# Altium schematic sheet GPRS.SchDoc
size A3
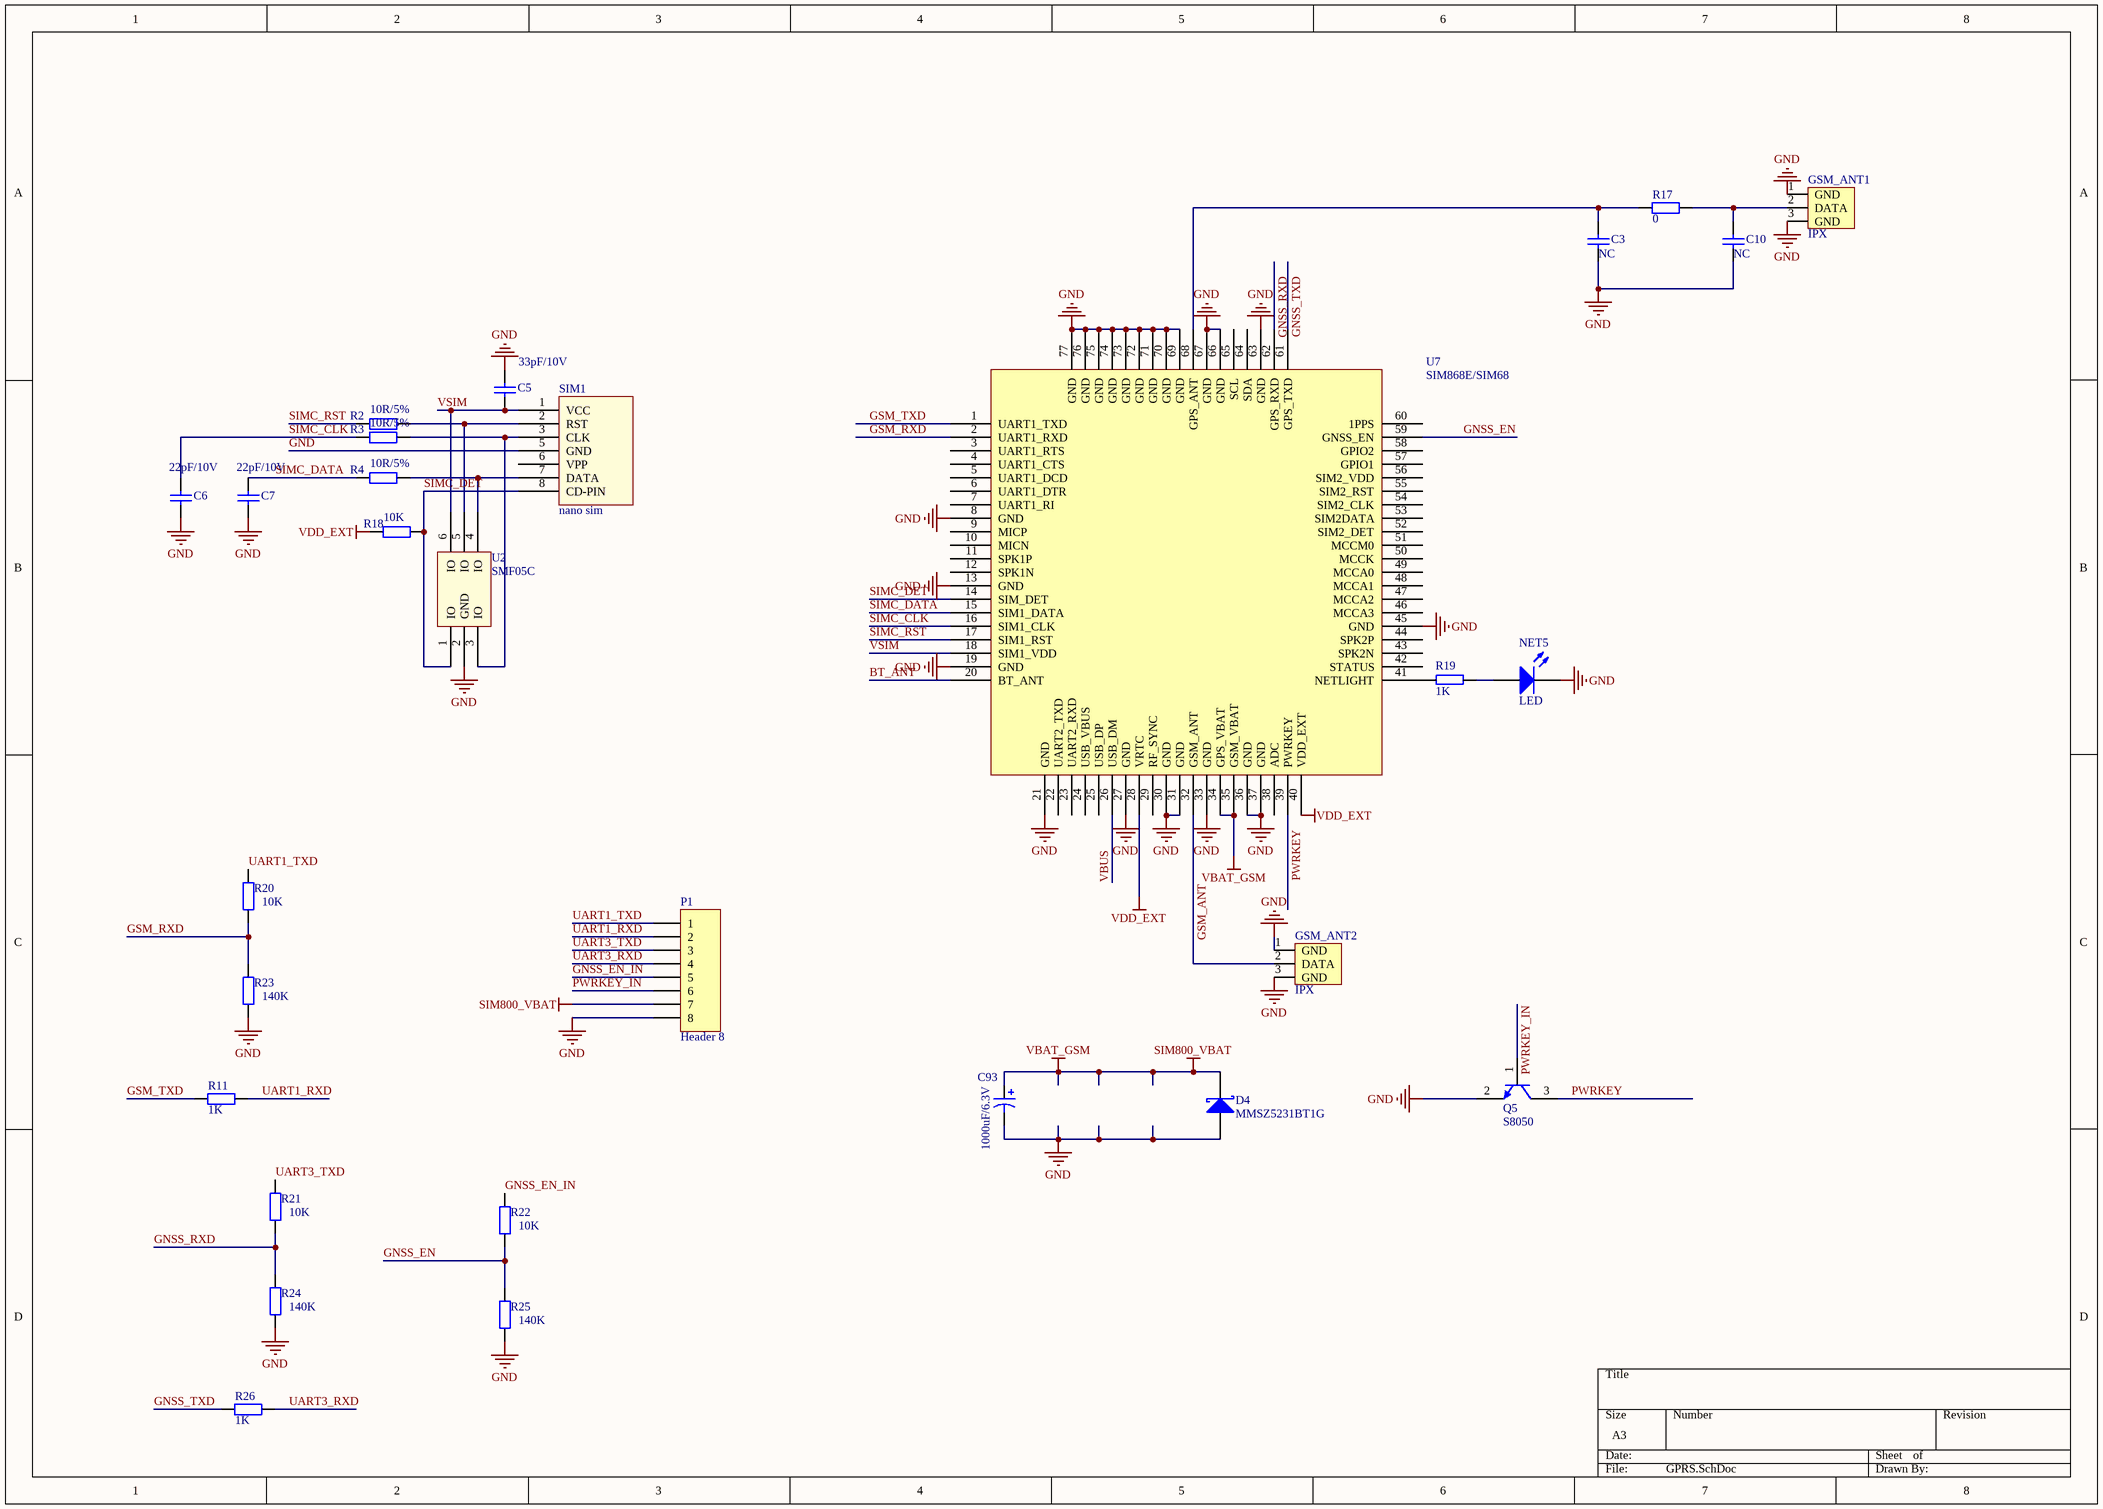
[diagram p0: GPRS.SchDoc]

## Parts
C3  NC  [0603C]
C5  33pF/10V  [0603C]
C6  22pF/10V  [0603C]
C7  22pF/10V  [0603C]
C10  NC  [0603C]
C93  1000uF/6.3V  [7343]
D4  MMSZ5231BT1G  [SOD123]
GSM_ANT1  IPX  [IPX]
GSM_ANT2  IPX  [IPX]
NET5  LED  [0603LED]
P1  Header 8  [HDR1X8]
Q5  S8050  [SOT23-3]
R2  10R/5%  [0603R]
R3  10R/5%  [0603R]
R4  10R/5%  [0603R]
R11  1K  [0603R]
R17  0  [0603R]
R18  10K  [0603R]
R19  1K  [0603r]
R20  10K  [0603R]
R21  10K  [0603R]
R22  10K  [0603R]
R23  140K  [0603R]
R24  140K  [0603R]
R25  140K  [0603R]
R26  1K  [0603R]
SIM1  nano sim  [Nano SIM]
U2  SMF05C  [SC70-6L]
U7  SIM868E/SIM68  [SIM868]

## Nets
GND: C3.2 C5.1 C6.2 C7.2 C10.2 C93.2 D4.1(A) GSM_ANT1.1(GND) GSM_ANT1.3(GND) GSM_ANT2.1(GND) GSM_ANT2.3(GND) NET5.2(K) P1.8 Q5.2(E) R23.2 R24.2 R25.2 SIM1.5(GND) U2.2(GND) U7.8(GND) U7.13(GND) U7.19(GND) U7.21(GND) U7.27(GND) U7.30(GND) U7.31(GND) U7.33(GND) U7.36(GND) U7.37(GND) U7.45(GND) U7.63(GND) U7.66(GND) U7.67(GND) U7.69(GND) U7.70(GND) U7.71(GND) U7.72(GND) U7.73(GND) U7.74(GND) U7.75(GND) U7.76(GND) U7.77(GND)
SIM800_VBAT: C93.1 D4.2(K) P1.7 U7.34(GPS_VBAT) U7.35(GSM_VBAT)  [also labelled VBAT_GSM]
VDD_EXT: R18.2 U7.28(VRTC) U7.40(VDD_EXT)
BT_ANT: U7.20(BT_ANT)
GNSS_EN: R22.2 R25.1 U7.59(GNSS_EN)
GNSS_EN_IN: P1.5 R22.1
GNSS_RXD: R21.2 R24.1 U7.62(GPS_RXD)
GNSS_TXD: R26.1 U7.61(GPS_TXD)
GSM_ANT: GSM_ANT2.2(DATA) U7.32(GSM_ANT)
GSM_RXD: R20.2 R23.1 U7.2(UART1_RXD)
GSM_TXD: R11.1 U7.1(UART1_TXD)
PWRKEY: Q5.3(C) U7.39(PWRKEY)
PWRKEY_IN: P1.6 Q5.1(B)
SIMC_CLK: C6.1 R3.2 U7.16(SIM1_CLK)
SIMC_DATA: C7.1 R4.2 U7.15(SIM1_DATA)
SIMC_DET: R18.1 SIM1.8(CD-PIN) U2.1(IO) U7.14(SIM_DET)
SIMC_RST: R2.2 U7.17(SIM1_RST)
UART1_RXD: P1.2 R11.2
UART1_TXD: P1.1 R20.1
UART3_RXD: P1.4 R26.2
UART3_TXD: P1.3 R21.1
VBUS: U7.26(USB_DM)
VSIM: C5.2 SIM1.1(VCC) U2.6(IO) U7.18(SIM1_VDD)
NetC3_1: C3.1 R17.1 U7.68(GPS_ANT)
NetC10_1: C10.1 GSM_ANT1.2(DATA) R17.2
NetNET5_1: NET5.1(A) R19.1
NetR2_1: R2.1 SIM1.2(RST) U2.5(IO)
NetR3_1: R3.1 SIM1.3(CLK) U2.3(IO)
NetR4_1: R4.1 SIM1.7(DATA) U2.4(IO)
NetR19_2: R19.2 U7.41(NETLIGHT)

Not connected (* = marked no-connect by the designer): SIM1 6(VPP); U7 3(UART1_RTS) 4(UART1_CTS) 5(UART1_DCD) 6(UART1_DTR) 7(UART1_RI) 9(MICP) 10(MICN) 11(SPK1P) 12(SPK1N) 22(UART2_TXD) 23(UART2_RXD) 24(USB_VBUS) 25(USB_DP) 29(RF_SYNC) 38(ADC) 42(STATUS) 43(SPK2N) 44(SPK2P) 46(MCCA3) 47(MCCA2) 48(MCCA1) 49(MCCA0) 50(MCCK) 51(MCCM0) 52(SIM2_DET) 53(SIM2DATA) 54(SIM2_CLK) 55(SIM2_RST) 56(SIM2_VDD) 57(GPIO1) 58(GPIO2) 60(1PPS) 64(SDA) 65(SCL)

## Library data of the parts
C3 C5-C7 C10 = Cap: Capacitor; Value: 0.1uF/10V; Published: 8-Jun-2000; LatestRevisionDate: 17-Jul-2002; LatestRevisionNote: Re-released for DXP Platform.; PackageReference: RAD-0.3; Publisher: Altium Limited
C93 = Cap Pol1: Polarized Capacitor (Radial); Published: 8-Jun-2000; LatestRevisionDate: 17-Jul-2002; LatestRevisionNote: Re-released for DXP Platform.; PackageReference: RB7.6-15; Publisher: Altium Limited
D4 = Diode 10TQ040: Schottky Rectifier; Note: Terminal 2 is the TAB and is electrically connected to the cathode; Published: 8-Jun-2000; LatestRevisionDate: 17-Jul-2002; LatestRevisionNote: Re-released for DXP Platform.; DatasheetVersion: PD-2.057B; PackageVersion: Feb-1998; PackageReference: TO-220AC; Publisher: Altium Limited; ComponentLink1Description: Manufacturer Link; ComponentLink1URL: http://www.irf.com/
GSM_ANT1 GSM_ANT2 = IPEX: IPEX座
NET5 = LED2: Typical RED, GREEN, YELLOW, AMBER GaAs LED; Published: 8-Jun-2000; LatestRevisionDate: 17-Jul-2002; LatestRevisionNote: Re-released for DXP Platform.; PackageDocument: Feb-2002; PackageReference: 3.2X1.6X1.1; Publisher: Altium Limited
P1 = Header 8: Header, 8-Pin; LatestRevisionDate: 17-Jul-2002; LatestRevisionNote: Re-released for DXP Platform.; Publisher: Altium Limited
Q5 = NPN
R2-R4 R18 = Res2: Resistor; Value: 10R; Published: 8-Jun-2000; LatestRevisionDate: 17-Jul-2002; LatestRevisionNote: Re-released for DXP Platform.; PackageReference: AXIAL-0.4; Publisher: Altium Limited
R11 R20-R26 = Res2: Resistor; Value: 0; Published: 8-Jun-2000; LatestRevisionDate: 17-Jul-2002; LatestRevisionNote: Re-released for DXP Platform.; PackageReference: AXIAL-0.4; Publisher: Altium Limited
R17 = Res2: Resistor; Published: 8-Jun-2000; LatestRevisionDate: 17-Jul-2002; LatestRevisionNote: Re-released for DXP Platform.; PackageReference: AXIAL-0.4; Publisher: Altium Limited; Value: 0
R19 = R
U7 = SIM868E/SIM868